# EasyEDA schematic SCH_ColorMusic_Filtr_v2_2024-12-10.json
TITLE: Sheet_1; REV: 1.0; Date: 2021-08-26; Sheet: 1/1; Drawn By: Pavel Saenko; Company: Your Company
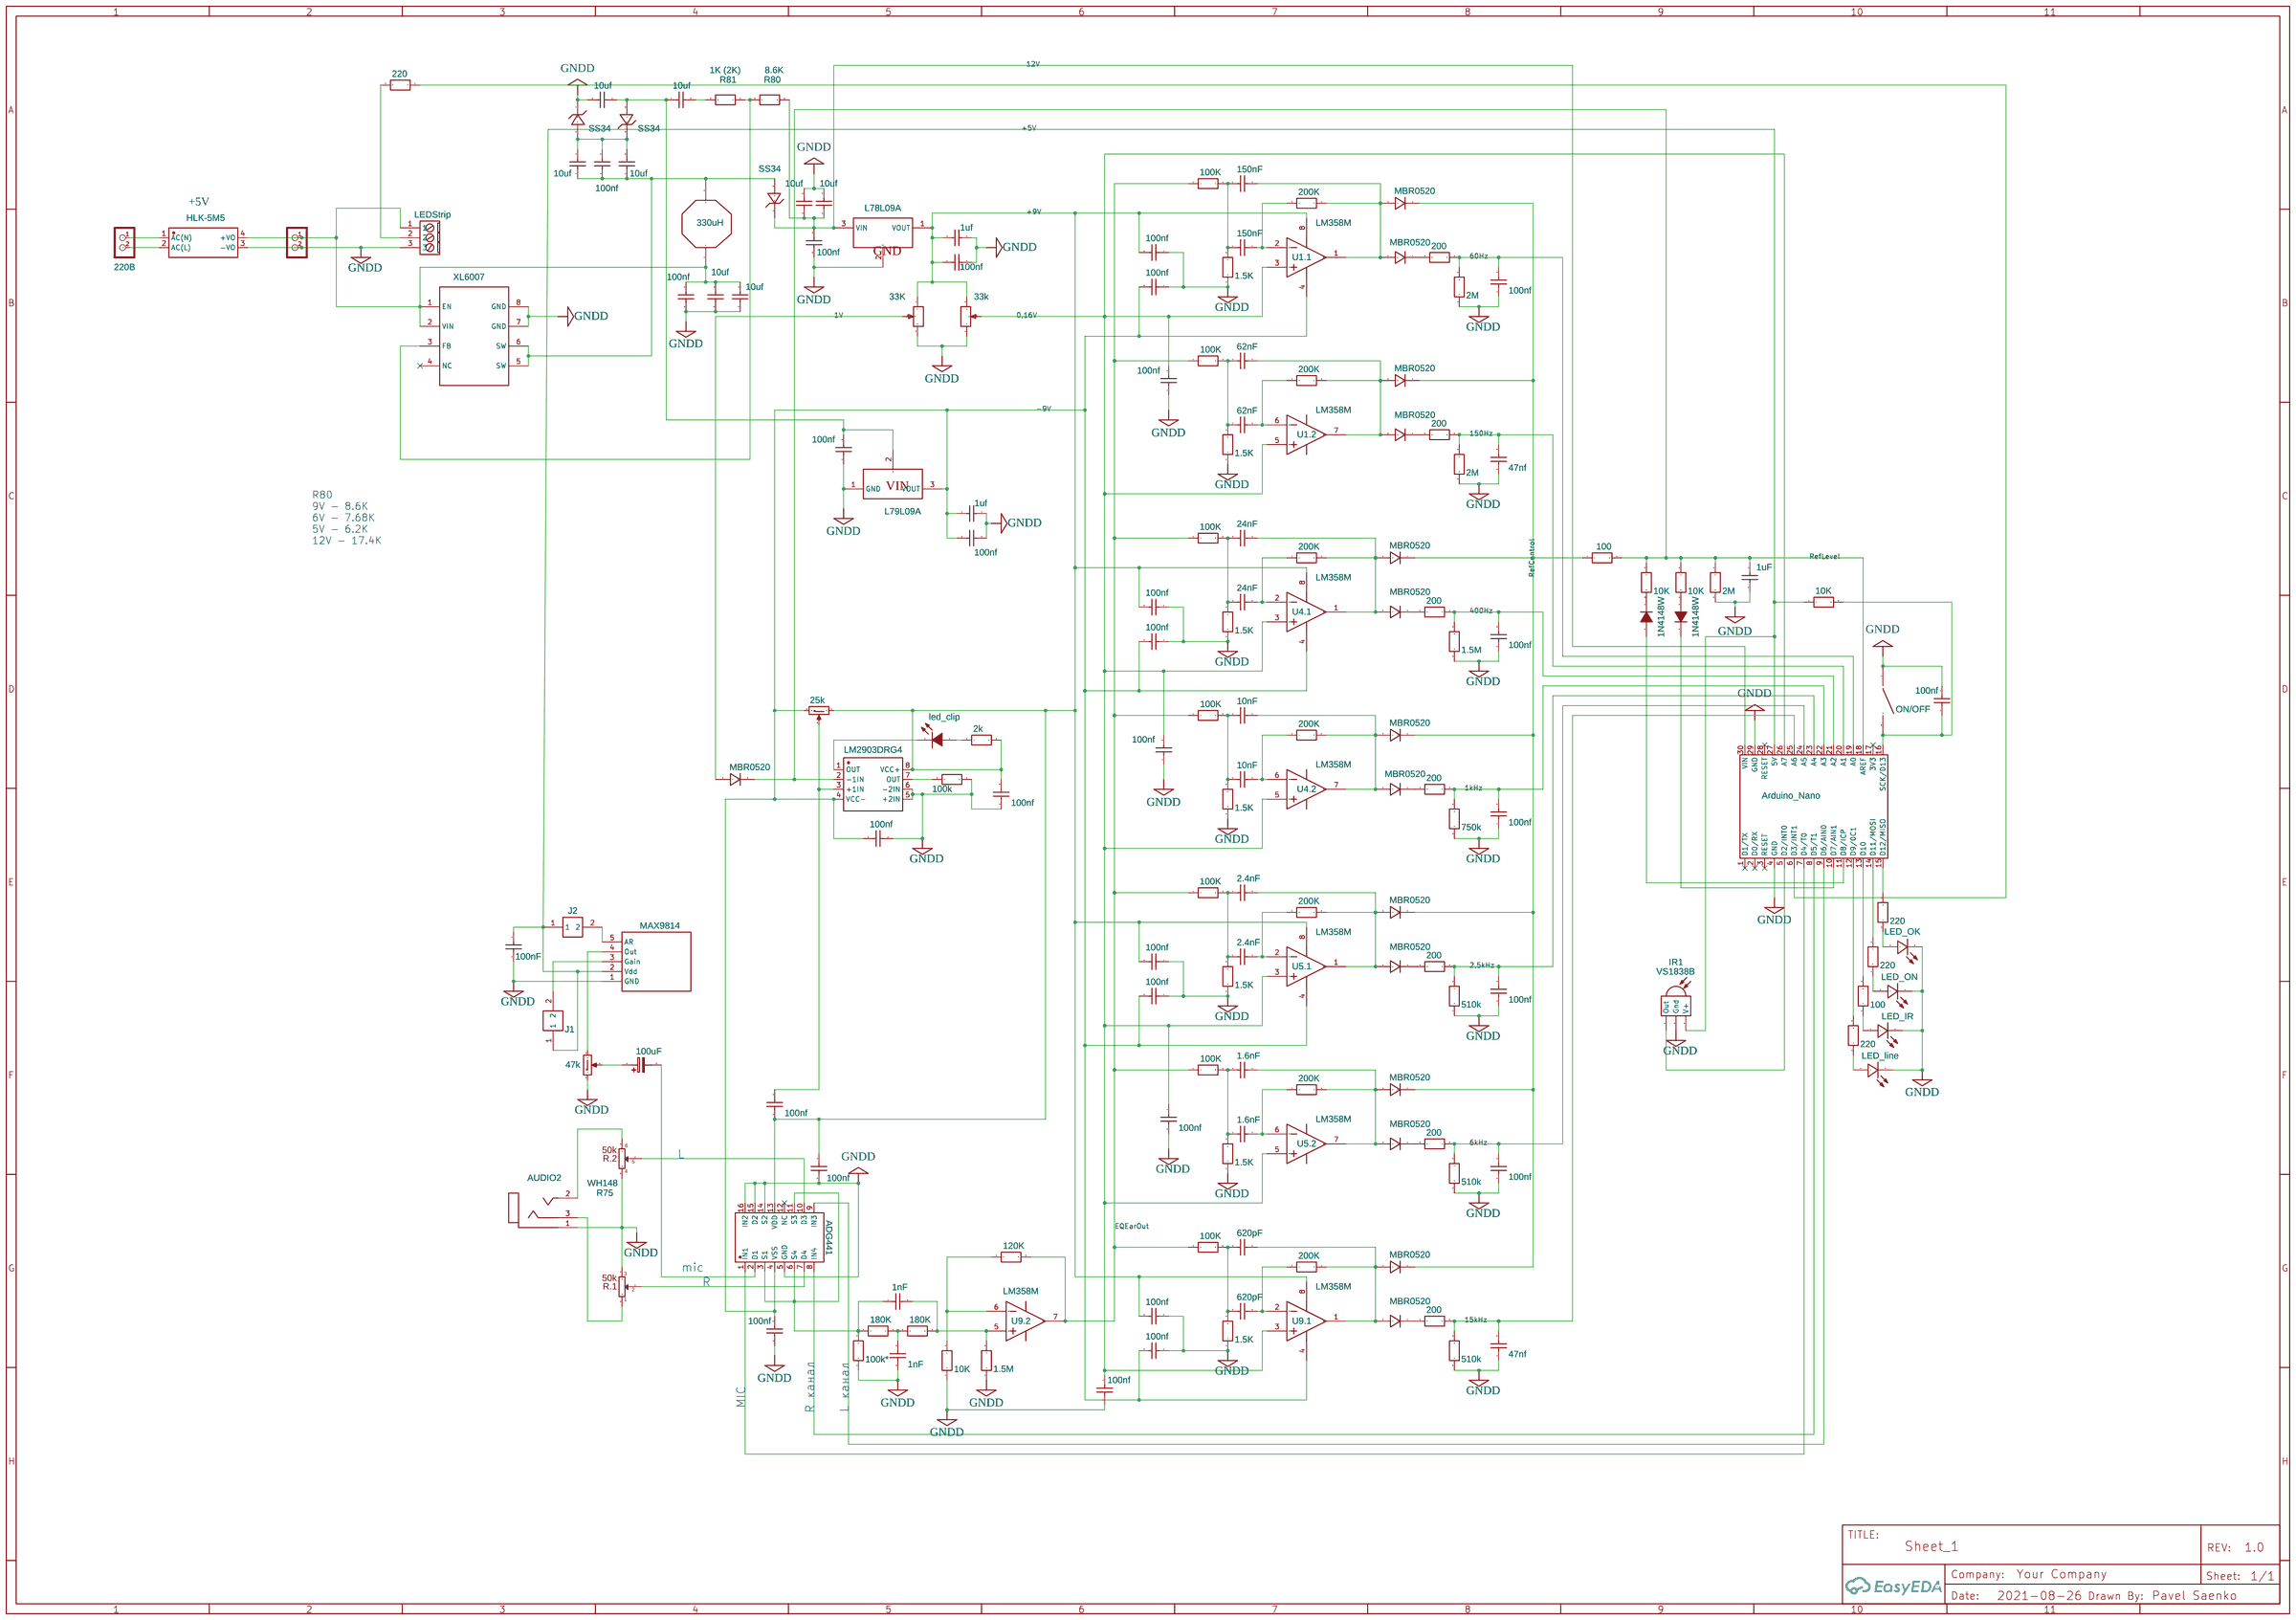
[diagram p0: schematic sheet]

## Parts
AUDIO2  KLS1-TSJ3.5-009  [KLS1-TSJ3.5-009]
C3  1nF  [C0805]
C6  100nf  [C0805]
C7  100uF  [CAP-D5.0-F2.0]
C8  62nF  [C0805]
C9  150nF  [C0805]
C10  62nF  [C0805]
C11  150nF  [C0805]
C12  47nf  [C0805]
C13  100nf  [C0805]
C14  24nF  [C0805]
C15  10nF  [C0805]
C17  24nF  [C0805]
C18  10nF  [C0805]
C19  100nf  [C0805]
C20  100nf  [C0805]
C21  2.4nF  [C0805]
C24  1.6nF  [C0805]
C25  2.4nF  [C0805]
C26  1.6nF  [C0805]
C27  100nf  [C0805]
C28  1uF  [C0805]
C29  620pF  [C0805]
C31  620pF  [C0805]
C32  1nF  [C0805]
C33  47nf  [C0805]
C40  100nF  [C0805]
C42  100nf  [C0805]
C44  100nf  [C0805]
C45  100nf  [C0805]
C46  100nf  [C0805]
C47  100nf  [C0805]
C48  100nf  [C0805]
C49  100nf  [C0805]
C50  100nf  [C0805]
C51  100nf  [C0805]
C55  100nf  [C0805]
C56  10uf  [C0805]
C57  100nf  [C0805]
C58  10uf  [C0805]
C59  100nf  [C0805]
C60  10uf  [C0805]
C61  10uf  [C0805]
C62  10uf  [C0805]
C63  10uf  [C0805]
C64  10uf  [C0805]
C65  100nf  [C0805]
C66  10uf  [C0805]
C67  1uf  [C0805]
C69  100nf  [C0805]
C70  100nf  [C0805]
C71  100nf  [C0805]
C73  100nf  [C0805]
C74  1uf  [C0805]
C75  100nf  [C0805]
C76  100nf  [C0805]
C77  100nf  [C0805]
C78  100nf  [C0805]
C79  100nf  [C0805]
C80  100nf  [C0805]
C81  100nf  [C0805]
D4  MBR0520  [SOD-123_L2.8-W1.8-LS3.7-RD]
D6  MBR0520  [SOD-123_L2.8-W1.8-LS3.7-RD]
D7  MBR0520  [SOD-123_L2.8-W1.8-LS3.7-RD]
D9  MBR0520  [SOD-123_L2.8-W1.8-LS3.7-RD]
D10  MBR0520  [SOD-123_L2.8-W1.8-LS3.7-RD]
D11  MBR0520  [SOD-123_L2.8-W1.8-LS3.7-RD]
D12  MBR0520  [SOD-123_L2.8-W1.8-LS3.7-RD]
D13  MBR0520  [SOD-123_L2.8-W1.8-LS3.7-RD]
D14  MBR0520  [SOD-123_L2.8-W1.8-LS3.7-RD]
D15  MBR0520  [SOD-123_L2.8-W1.8-LS3.7-RD]
D16  MBR0520  [SOD-123_L2.8-W1.8-LS3.7-RD]
D17  MBR0520  [SOD-123_L2.8-W1.8-LS3.7-RD]
D18  1N4148W  [SOD-123_L2.8-W1.8-LS3.7-RD]
D19  MBR0520  [SOD-123_L2.8-W1.8-LS3.7-RD]
D20  1N4148W  [SOD-123_L2.8-W1.8-LS3.7-RD]
D21  MBR0520  [SOD-123_L2.8-W1.8-LS3.7-RD]
D24  MBR0520  [SOD-123_L2.8-W1.8-LS3.7-RD]
HLK  HLK-5M5  [PWRM-TH_HLK-5M12_C917670]
IR1  VS1838B  [VS1838B]
J1  220В  [TERMINAL_BLOCK_2P_5]
J2  J2  [ПЕРЕМЫЧКА_3.5]
J3  LED power  [TERMINAL_BLOCK_2P_5]
J4  Arduino_Nano  [DIP-30_L43.18-W15.24-ARDUINONANO]
J5  J1  [ПЕРЕМЫЧКА_3.5]
J6  LEDStrip  [TERMINAL CLAMP PCB 3DS]
LED1  LED_line  [LED0805-RD]
LED3  LED_OK  [LED0805_BLUE]
LED4  LED_IR  [LED0805-RD]
LED5  LED_ON  [LED0805-RD]
R3  1.5M  [R0805]
R4  100  [R0805]
R10  100K  [R0805]
R11  100K  [R0805]
R12  200K  [R0805]
R13  200  [R0805]
R14  200  [R0805]
R15  1.5K  [R0805]
R16  1.5K  [R0805]
R17  200K  [R0805]
R18  2M  [R0805]
R19  2M  [R0805]
R20  100k*  [R0805]
R26  10K  [R0805]
R31  750k  [R0805]
R32  1.5M  [R0805]
R33  200K  [R0805]
R34  1.5K  [R0805]
R35  220  [R0805]
R36  220  [R0805]
R37  100  [R0805]
R38  220  [R0805]
R39  220  [R0805]
R40  180K  [R0805]
R41  1.5K  [R0805]
R42  180K  [R0805]
R43  200  [R0805]
R44  200  [R0805]
R45  200K  [R0805]
R46  100K  [R0805]
R47  100K  [R0805]
R50  510k  [R0805]
R51  510k  [R0805]
R52  200K  [R0805]
R53  1.5K  [R0805]
R54  1.5K  [R0805]
R55  200  [R0805]
R56  200  [R0805]
R57  200K  [R0805]
R58  100K  [R0805]
R59  100K  [R0805]
R60  10K  [R0805]
R62  10K  [R0805]
R63  510k  [R0805]
R64  200K  [R0805]
R65  1.5K  [R0805]
R66  2M  [R0805]
R67  200  [R0805]
R70  10K  [R0805]
R71  100K  [R0805]
R74  120K  [R0805]
R75  WH148  [POTENTIOMETER_ALPS_RK163_DOUBLE_VERTICAL]
R80  8.6K  [R0805]
R81  1K (2K)  [R0805]
R83  100k  [R0805]
R84  2k  [R0805]
SW2  ON/OFF  [KEY-TH_4P-L6.0-W6.0-P4.5-LS7.5]
T1  ADG441  [SOP-16_L10.0-W3.9-P1.27-LS6.0-BL]
U1  LM358M  [SOP-8_L4.9-W3.9-P1.27-LS6.0-BL]  (sections 1,2)
U3  XL6007  [SOIC-8_L5.0-W4.0-P1.27-LS6.0-BL]
U4  LM358M  [SOP-8_L4.9-W3.9-P1.27-LS6.0-BL]  (sections 1,2)
U5  LM358M  [SOP-8_L4.9-W3.9-P1.27-LS6.0-BL]  (sections 1,2)
U6  SS34  [SMB_L4.3-W3.6-LS5.4-RD]
U7  330uH  [SRU1048-100Y_JOSE]
U8  LM2903DRG4  [SOIC-8_L5.0-W4.0-P1.27-LS6.0-BL]
U9  LM358M  [SOP-8_L4.9-W3.9-P1.27-LS6.0-BL]  (sections 1,2)
U10  L78L09A  [TO-92-3_L4.8-W3.7-P2.54-L]
U12  L79L09A  [TO-92-3_L4.8-W3.7-P2.54-L]
U15  MAX9814  [MAX9814]
U16  led_clip  [LED0805-RD]
U17  SS34  [SMB_L4.3-W3.6-LS5.4-RD]
U18  SS34  [SMB_L4.3-W3.6-LS5.4-RD]
U19  33k  [RES-ADJ-SMD_3314J]
U20  33K  [RES-ADJ-SMD_3314J]
VR1  47k  [RES-ADJ-TH_3296W]
VR5  25k  [RES-ADJ-TH_3296W]

## Library data of the parts
AUDIO2 = KLS1-TSJ3.5-009: Supplier: Antenk; Contributor: msol
C3 C6 C8-C15 C17-C21 C24-C29 C31-C33 C40 C42 C44-C51 C55-C67 C69-C71 C73-C81 = 0.01uF(103) 100V: Supplier: LCSC; Manufacturer: ReliaPro; Supplier Part: C10722
C7 = Cap_Electrolytic(TH)_D8.0XF3.5_EU: Contributor: EasyEDA
D4 D6 D7 D9-D17 D19 D21 D24 = 1N4148W_C81598: Supplier: LCSC; Manufacturer: SEMTECH; Manufacturer Part: 1N4148W; Supplier Part: C81598; JLCPCB Part Class: Basic Part
D18 D20 = 1N4148W: Supplier: LCSC; Manufacturer: HT; Contributor: LCSC; Supplier Part: C179717; JLCPCB Part Class: Extended Part
HLK = HLK-5M05_C917669: Supplier: LCSC; Supplier Part: C917669; Manufacturer: TESL*A; Manufacturer Part: HLK-5M05; Contributor: LCSC; JLCPCB Part Class: Extended Part
IR1 = -: Contributor: Kr W
J1 J3 = -: 2 poles wire to board terminal block; Contributor: DangerousPrototype; sourceId: mWQ7pjBvN
J2 J5 = ПЕРЕМЫЧКА_3.5: Contributor: Vovic
J4 = Arduino_Nano_Header
J6 = TERMINAL_CLAMP_DPS_3DS: catid: 20; Contributor: TomB70; Supplier Part: AK550/3DS-3.5-V; Supplier: PTR; sim: true; Manufacturer Part: AK550/3DS-3.5-V; Manufacturer: PTR
LED1 LED3-LED5 = -: Supplier: LCSC; Manufacturer: KENTO; Manufacturer Part: 5AR2ST10; Supplier Part: C52721
R3 R4 R10-R20 R26 R31-R47 R50-R60 R62-R67 R70 R71 R74 R80 R81 R83 R84 = Res_AXIAL-0.4(1/4W)_EU
R75 = WH148: Contributor: vikmaster.ua; Manufacturer Part: 1
SW2 = EVQ22705R: Supplier: LCSC; Manufacturer: PANASONIC; Contributor: LCSC; Supplier Part: C79156
T1 = ADG441ABRZ-REEL: Supplier: LCSC; Supplier Part: C655343; Manufacturer: ADI(亚德诺)/LINEAR; link: https://atta.szlcsc.comnull; Contributor: LCSC
U1 U4 U5 U9 = LM358M/TR: Supplier: LCSC; Supplier Part: C398078; Manufacturer: HGSEMI; subpart_no: 1; JLCPCB Part Class: Extended Part
U3 = XL6007E1: Supplier: LCSC; Manufacturer: XLSEMI(芯龙); Supplier Part: C73334; JLCPCB Part Class: Extended Part
U6 U17 U18 = 1N5822-SS34: Supplier: LCSC; Supplier Part: C9900010596; Manufacturer: null; Contributor: LCSC; JLCPCB Part Class: Extended Part
U7 = SRU1048-100Y COPY: Manufacturer: Bourns; Manufacturer Part: SRU1048-331Y; Supplier Part: SRU1048-331YCT-ND; Supplier: Digi-Key; Contributor: Austin Wagner
U8 = LM2903DRG4: Supplier: LCSC; Manufacturer: TI; Supplier Part: C7549; SMT Type: Extend; JLCPCB SMD: Yes; LCSC Assembly: Yes
U10 U12 = L78L09ACZ-AP: Supplier: LCSC; Supplier Part: C262912; Manufacturer: ST(意法半导体); Contributor: LCSC; JLCPCB Part Class: Extended Part
U15 = MAX9814: Contributor: allvex
U16 = TEMD6200FX01: Supplier: LCSC; Supplier Part: C499517; Manufacturer: Vishay Intertech; Contributor: LCSC
U19 U20 = 3314J-1: Supplier: LCSC; Supplier Part: C9900016830; Manufacturer: null; Contributor: lcsc; JLCPCB Part Class: Extended Part
VR1 VR5 = Pot: Contributor: jesuecc83; license: https://www.gnu.org/licenses/lgpl-2.1.html

## Nets
1V: D24.2(A) U20.2
12V: C63.2 C64.2 C65.2 J4.30(VIN) R80.1 U6.1(C) U10.3(VIN)
+5V: C40.1 IR1.3(V+) J2.1 J4.27(5V) J5.1 R26.1 U15.2(Vdd)
+9V: C44.2 C47.2 C49.2 C51.2 C71.2 C73.1 C74.2 C75.2 C81.1 R84.2 T1.13(VDD) U1.8(VCC) U4.8(VCC) U5.8(VCC) U8.8(VCC+) U9.8(VCC) U10.1(VOUT) U19.3 U20.1 VR5.1
-9V: C45.2 C46.2 C48.2 C50.2 C67.1 C69.1 C70.1 C76.2 T1.4(VSS) U1.4(GND) U4.4(GND) U5.4(GND) U8.4(VCC-) U9.4(GND) U12.3(VOUT) VR5.3
GNDD: AUDIO2.1 C6.1 C12.1 C13.1 C19.1 C20.1 C27.1 C28.2 C32.1 C33.1 C40.2 C42.1 C44.1 C45.1 C46.1 C47.1 C48.1 C49.1 C50.1 C51.1 C55.2 C56.2 C59.1 C60.2 C61.2 C63.1 C64.1 C65.1 C67.2 C69.2 C70.2 C71.1 C73.2 C74.1 C75.1 C76.1 C77.2 C78.2 C79.1 C80.1 HLK.3(-VO) IR1.2(Gnd) J3.2 J4.4(GND) J4.29(GND) J6.3 LED1.2(-) LED3.2(-) LED4.2(-) LED5.2(-) R3.1 R15.1 R16.1 R18.1 R19.1 R20.1 R31.1 R32.1 R34.1 R41.1 R50.1 R51.1 R53.1 R54.1 R63.1 R65.1 R66.2 R70.1 R75.1 R75.6 R83.2 SW2.A(1) T1.5(GND) T1.14(S2) T1.15(D2) T1.16(IN2) U3.7(GND) U3.8(GND) U8.5(+2IN) U8.6(-2IN) U10.2(GND) U12.1(GND) U15.1(GND) U18.1(C) U19.1 U20.3 VR1.3
0,16V: C77.1 C78.1 C79.2 C80.2 J4.26(A7) U1.3(1IN+) U1.5(2IN+) U4.3(1IN+) U4.5(2IN+) U5.3(1IN+) U5.5(2IN+) U9.3(1IN+) U19.2
1kHz: C13.2 J4.22(A3) R31.2 R44.2
2,5kHz: C27.2 J4.23(A4) R51.2 R55.2
6kHz: C20.2 J4.24(A5) R50.2 R56.2
15kHz: C33.2 J4.25(A6) R63.2 R67.2
60Hz: C6.2 J4.19(A0) R14.2 R18.2
150Hz: C12.2 J4.20(A1) R13.2 R19.2
400Hz: C19.2 J4.21(A2) R32.2 R43.2
EQEarOut: R10.1 R11.1 R46.1 R47.1 R58.1 R59.1 R71.1 R74.2 U9.7(2OUT)
RefControl: D7.1(K) D9.1(K) D10.1(K) D11.1(K) D14.1(K) D15.1(K) D19.1(K) R4.1
RefLevel: C28.1 D24.1(K) J4.18(AREF) R4.2 R60.1 R62.1 R66.1 U8.2(-1IN)
Net-(AUDIO2-2): AUDIO2.2 R75.4
Net-(AUDIO2-3): AUDIO2.3 R75.3
Net-(C3-1): C3.1 R20.2 R40.1 T1.3(S1) T1.6(S4) T1.11(S3)
Net-(C3-2): C3.2 R3.2 R42.2 U9.5(2IN+)
Net-(C7-1): C7.1 VR1.2
Net-(C7-2): C7.2 T1.2(D1)
Net-(C8-1): C8.1 C10.1 R11.2 R15.2
Net-(C8-2): C8.2 D6.2(A) D9.2(A) R12.2 U1.7(2OUT)
Net-(C9-1): C9.1 C11.1 R10.2 R16.2
Net-(C9-2): C9.2 D4.2(A) D7.2(A) R17.2 U1.1(1OUT)
Net-(C10-2): C10.2 R12.1 U1.6(2IN-)
Net-(C11-2): C11.2 R17.1 U1.2(1IN-)
Net-(C14-1): C14.1 C17.1 R34.2 R47.2
Net-(C14-2): C14.2 R33.1 U4.2(1IN-)
Net-(C15-1): C15.1 C18.1 R41.2 R46.2
Net-(C15-2): C15.2 R45.1 U4.6(2IN-)
Net-(C17-2): C17.2 D11.2(A) D13.2(A) R33.2 U4.1(1OUT)
Net-(C18-2): C18.2 D10.2(A) D12.2(A) R45.2 U4.7(2OUT)
Net-(C21-1): C21.1 C25.1 R53.2 R59.2
Net-(C21-2): C21.2 R52.1 U5.2(1IN-)
Net-(C24-1): C24.1 C26.1 R54.2 R58.2
Net-(C24-2): C24.2 R57.1 U5.6(2IN-)
Net-(C25-2): C25.2 D15.2(A) D17.2(A) R52.2 U5.1(1OUT)
Net-(C26-2): C26.2 D14.2(A) D16.2(A) R57.2 U5.7(2OUT)
Net-(C29-1): C29.1 C31.1 R65.2 R71.2
Net-(C29-2): C29.2 R64.1 U9.2(1IN-)
Net-(C31-2): C31.2 D19.2(A) D21.2(A) R64.2 U9.1(1OUT)
Net-(C32-2): C32.2 R40.2 R42.1
Net-(C42-2): C42.2 J4.16(SCK/D13) R26.2 SW2.B(2)
Net-(C55-1): C55.1 C56.1 C61.1 HLK.4(+VO) J3.1 J6.1 U3.1(EN) U3.2(VIN) U7.1
Net-(C57-1): C57.1 C58.1 C62.1 U3.5(SW) U3.6(SW) U6.2(A) U7.2
Net-(C57-2): C57.2 C58.2 C62.2 U17.1(C) U18.2(A)
Net-(C59-2): C59.2 C60.1 C66.1 U12.2(GND) U17.2(A)
Net-(C66-2): C66.2 R81.2
Net-(C81-2): C81.2 U8.3(+1IN) VR5.2
Net-(D4-1): D4.1(K) R14.1
Net-(D6-1): D6.1(K) R13.1
Net-(D12-1): D12.1(K) R44.1
Net-(D13-1): D13.1(K) R43.1
Net-(D16-1): D16.1(K) R56.1
Net-(D17-1): D17.1(K) R55.1
Net-(D18-1): D18.1(K) J4.10(D7/AIN1)
Net-(D18-2): D18.2(A) R62.2
Net-(D20-1): D20.1(K) R60.2
Net-(D20-2): D20.2(A) J4.11(D8/ICP)
Net-(D21-1): D21.1(K) R67.1
Net-(HLK-1): HLK.1(AC(N)) J1.1
Net-(HLK-2): HLK.2(AC(L)) J1.2
Net-(IR1-1): IR1.1(Out) J4.5(D2/INT0)
Net-(J2-2): J2.2 U15.5(AR)
Net-(J4-6): J4.6(D3/INT1) R35.1
Net-(J4-7): J4.7(D4/T0) T1.1(IN1)
Net-(J4-8): J4.8(D5/T1) T1.8(IN4)
Net-(J4-9): J4.9(D6/AIN0) T1.9(IN3)
Net-(J4-12): J4.12(D9/0C1) R36.2
Net-(J4-13): J4.13(D10) R37.2
Net-(J4-14): J4.14(D11/MOSI) R38.2
Net-(J4-15): J4.15(D12/MISO) R39.2
Net-(J5-2): J5.2 U15.3(Gain)
Net-(J6-2): J6.2 R35.2
Net-(LED1-1): LED1.1(+) R36.1
Net-(LED3-1): LED3.1(+) R39.1
Net-(LED4-1): LED4.1(+) R37.1
Net-(LED5-1): LED5.1(+) R38.1
Net-(R70-2): R70.2 R74.1 U9.6(2IN-)
Net-(R75-2): R75.2 T1.7(D4)
Net-(R75-5): R75.5 T1.10(D3)
Net-(R80-2): R80.2 R81.1 U3.3(FB)
Net-(R83-1): R83.1 U8.7(OUT)
Net-(R84-1): R84.1 U16.2(A)
Net-(U8-1): U8.1(OUT) U16.1(C)
Net-(U15-4): U15.4(Out) VR1.1

Not connected (* = marked no-connect by the designer): J4 1(D1/TX)* 2(D0/RX)* 3(RESET)* 17(3V3)* 28(RESET)*; T1 12(NC)*; U3 4(NC)*

## Notes on the sheet
- +5V
- R80
  9V - 8.6K
  6V - 7.68K
  5V - 6.2K
  12V - 17.4K
- L
- mic
- R
- MIC
- R канал
- L канал
